# EAGLE design mctl5 (EAGLE 7.5.0)
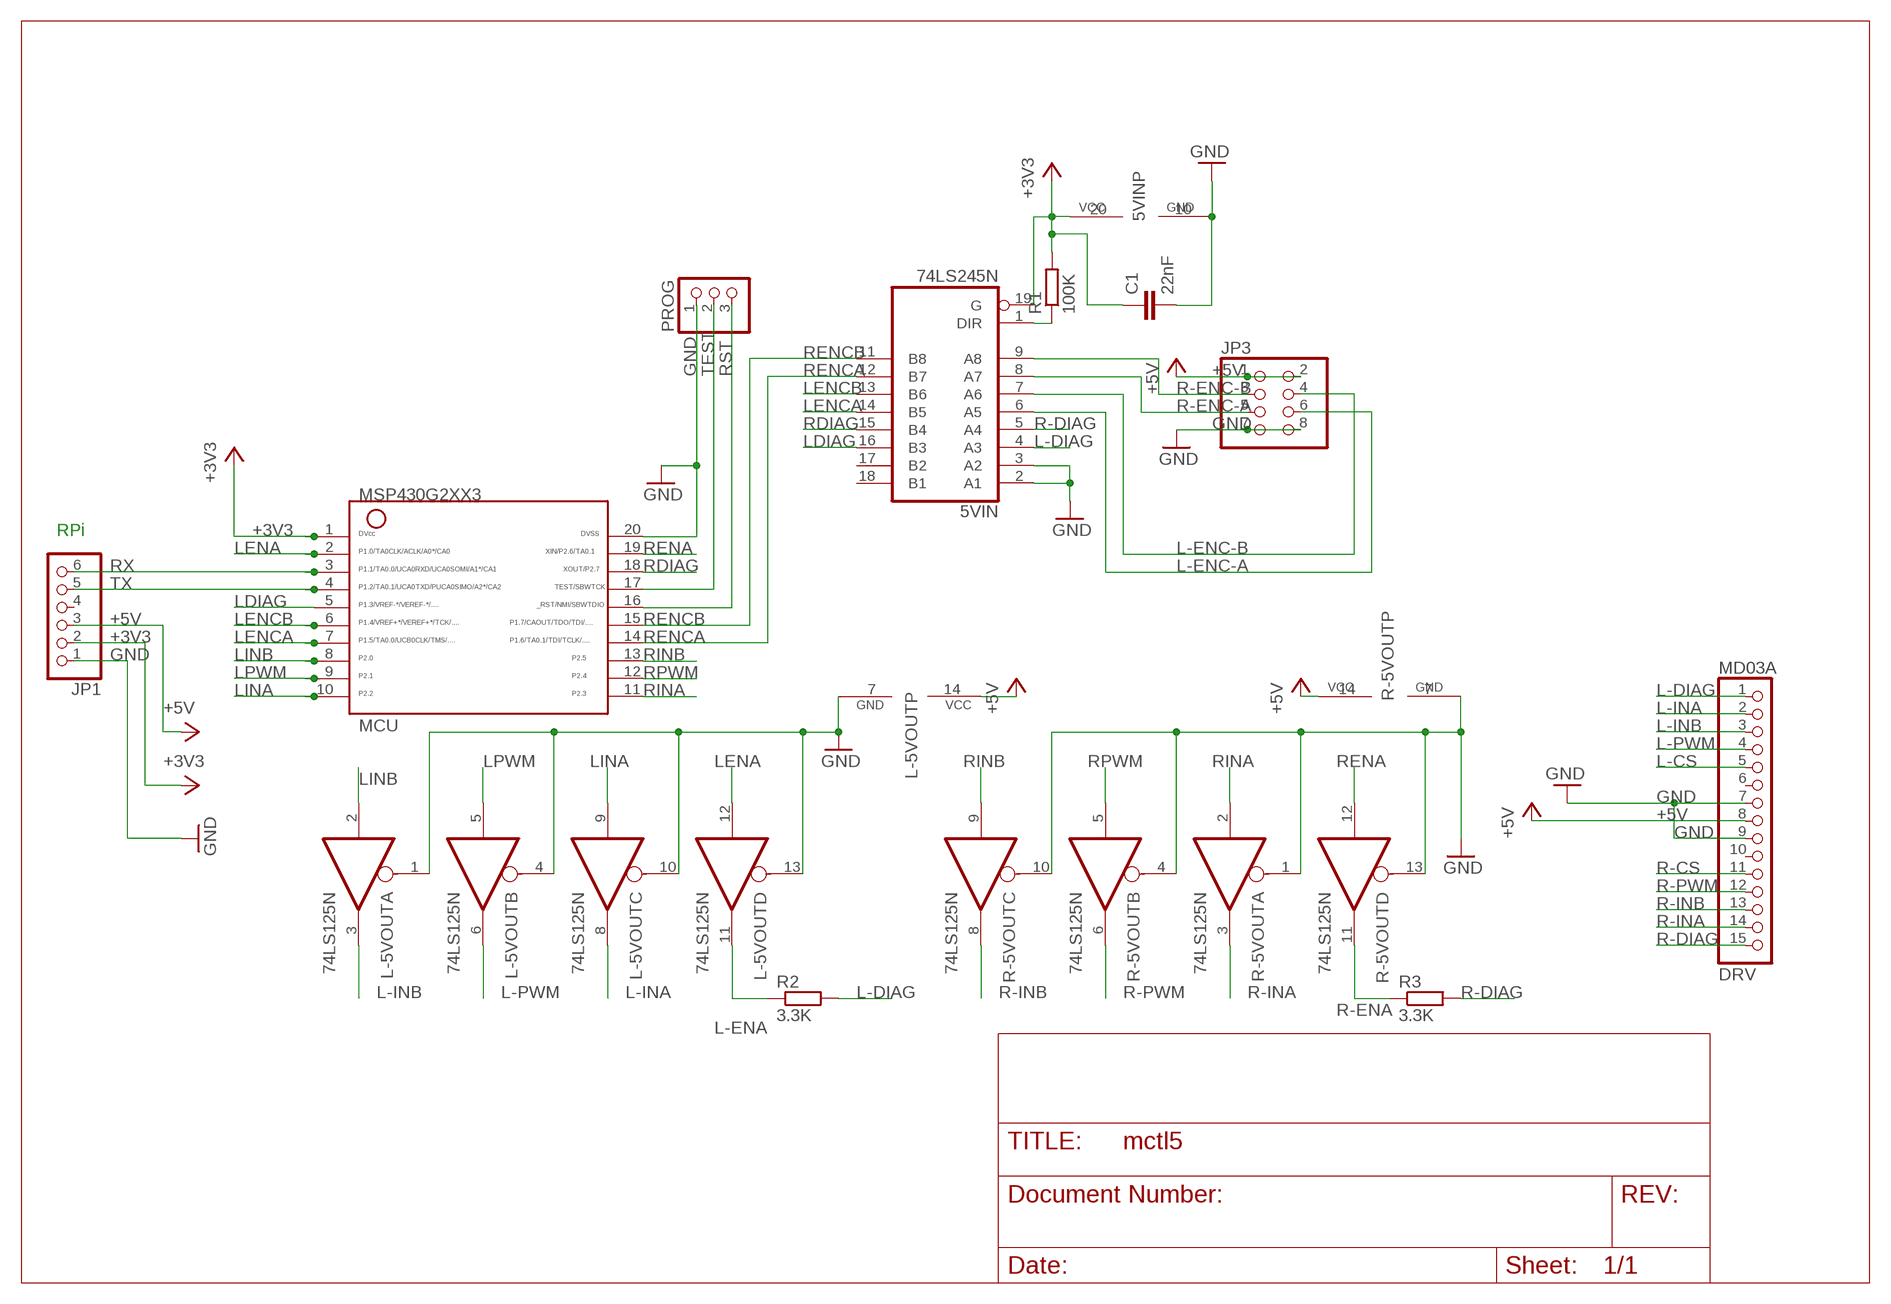
[diagram p0: schematic, sheet 1]

## Parts
5VIN  74LS245N  [DIL20]
C1  22nF  C-EU025-024X044  [C025-024X044]
JP1  PINHD-1X6  [1X06]
JP3  PINHD-2X4  [2X04]
L-5VOUT  74LS125N  [DIL14]
MCU  G2XX3---N20  [N20]
MD03A  DRV  PINHD-1X15-CB  [1X15-CB]
PROG  PINHD-1X3  [1X03]
R1  100K  R-EU_0204/7  [0204/7]
R2  3.3K  R-EU_0204/7  [0204/7]
R3  3.3K  R-EU_0204/7  [0204/7]
R-5VOUT  74LS125N  [DIL14]

## Nets
+3V3: 5VIN.19(G) 5VIN.20(VCC) C1.1 JP1.2 MCU.1 R1.2
+5V: JP1.3 JP3.1 JP3.2 L-5VOUT.14(P:VCC) MD03A.8 R-5VOUT.14(P:VCC)
GND: 5VIN.2(A1) 5VIN.3(A2) 5VIN.10(GND) C1.2 JP1.1 JP3.7 JP3.8 L-5VOUT.1(A:OE) L-5VOUT.4(B:OE) L-5VOUT.7(P:GND) L-5VOUT.10(C:OE) L-5VOUT.13(D:OE) MCU.20 MD03A.7 MD03A.9 PROG.1 R-5VOUT.1(A:OE) R-5VOUT.4(B:OE) R-5VOUT.7(P:GND) R-5VOUT.10(C:OE) R-5VOUT.13(D:OE)
L-CS: MD03A.5
L-DIAG: 5VIN.4(A3) MD03A.1 R2.2
L-ENA: L-5VOUT.11(D:O) R2.1
L-ENC-A: 5VIN.6(A5) JP3.6
L-ENC-B: 5VIN.7(A6) JP3.4
L-INA: L-5VOUT.8(C:O) MD03A.2
L-INB: L-5VOUT.3(A:O) MD03A.3
L-PWM: L-5VOUT.6(B:O) MD03A.4
LDIAG: 5VIN.16(B3) MCU.5
LENA: L-5VOUT.12(D:I) MCU.2
LENCA: 5VIN.14(B5) MCU.7
LENCB: 5VIN.13(B6) MCU.6
LINA: L-5VOUT.9(C:I) MCU.10
LINB: L-5VOUT.2(A:I) MCU.8
LPWM: L-5VOUT.5(B:I) MCU.9
N$1: 5VIN.1(DIR) R1.1
R-CS: MD03A.11
R-DIAG: 5VIN.5(A4) MD03A.15 R3.2
R-ENA: R3.1 R-5VOUT.11(D:O)
R-ENC-A: 5VIN.8(A7) JP3.5
R-ENC-B: 5VIN.9(A8) JP3.3
R-INA: MD03A.14 R-5VOUT.3(A:O)
R-INB: MD03A.13 R-5VOUT.8(C:O)
R-PWM: MD03A.12 R-5VOUT.6(B:O)
RDIAG: 5VIN.15(B4) MCU.18
RENA: MCU.19 R-5VOUT.12(D:I)
RENCA: 5VIN.12(B7) MCU.14
RENCB: 5VIN.11(B8) MCU.15
RINA: MCU.11 R-5VOUT.2(A:I)
RINB: MCU.13 R-5VOUT.9(C:I)
RPWM: MCU.12 R-5VOUT.5(B:I)
RST: MCU.16 PROG.3
RX: JP1.6 MCU.3
TEST: MCU.17 PROG.2
TX: JP1.5 MCU.4
Unconnected: 5VIN.17(B2) 5VIN.18(B1) JP1.4 MD03A.6 MD03A.10

## Notes on the sheet
- RPi

## Library data of the parts
5VIN = adafruit:74*245: Octal BUS TRANSCEIVER, 3-state
C1 = rcl:C-EU: CAPACITOR, European symbol
JP1 = adafruit:PINHD-1X6: PIN HEADER
JP3 = adafruit:PINHD-2X4: PIN HEADER
L-5VOUT R-5VOUT = 74xx-us:74*125: Quad bus BUFFER, 3-state
MCU = TI_MSP430_v16:G2XX3---N20: MSP430G2XX1 PDIP (N) 20 Pin Package
MD03A = adafruit:PINHD-1X15: PIN HEADER
PROG = adafruit:PINHD-1X3: PIN HEADER
R1-R3 = resistor:R-EU_: RESISTOR, European symbol

## Board
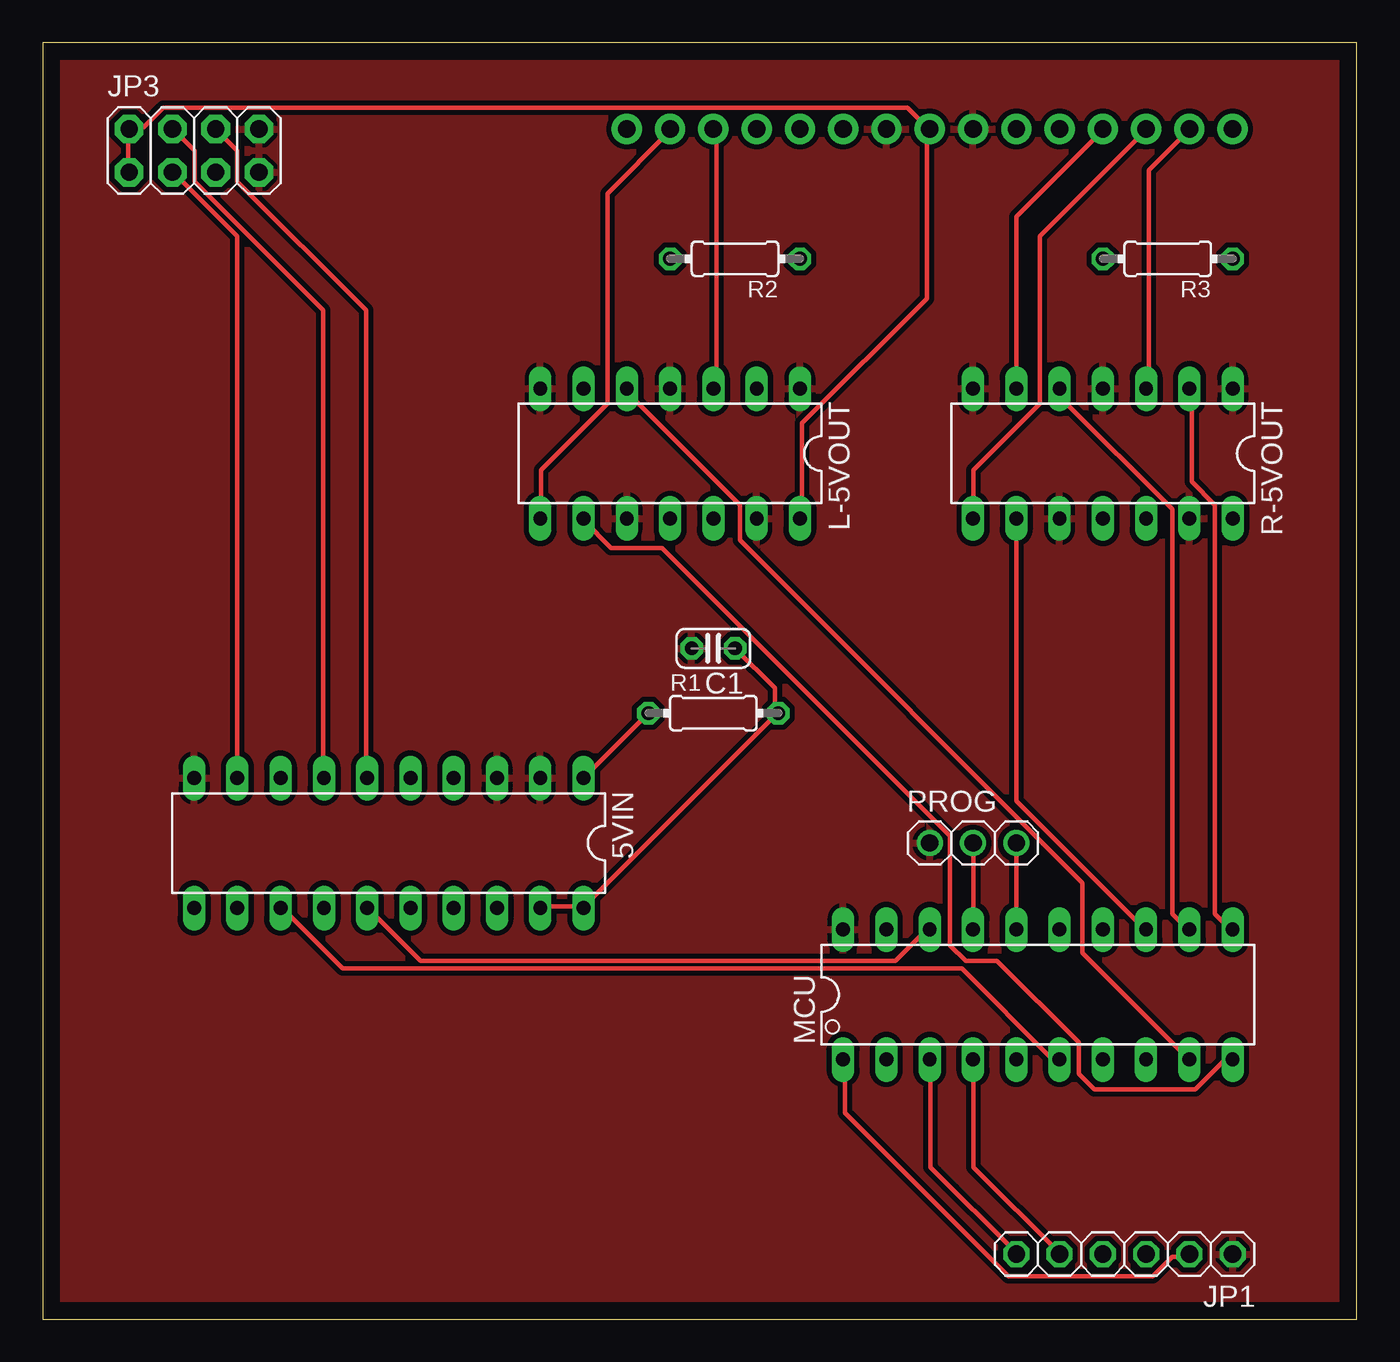
[diagram p1: board, top side]
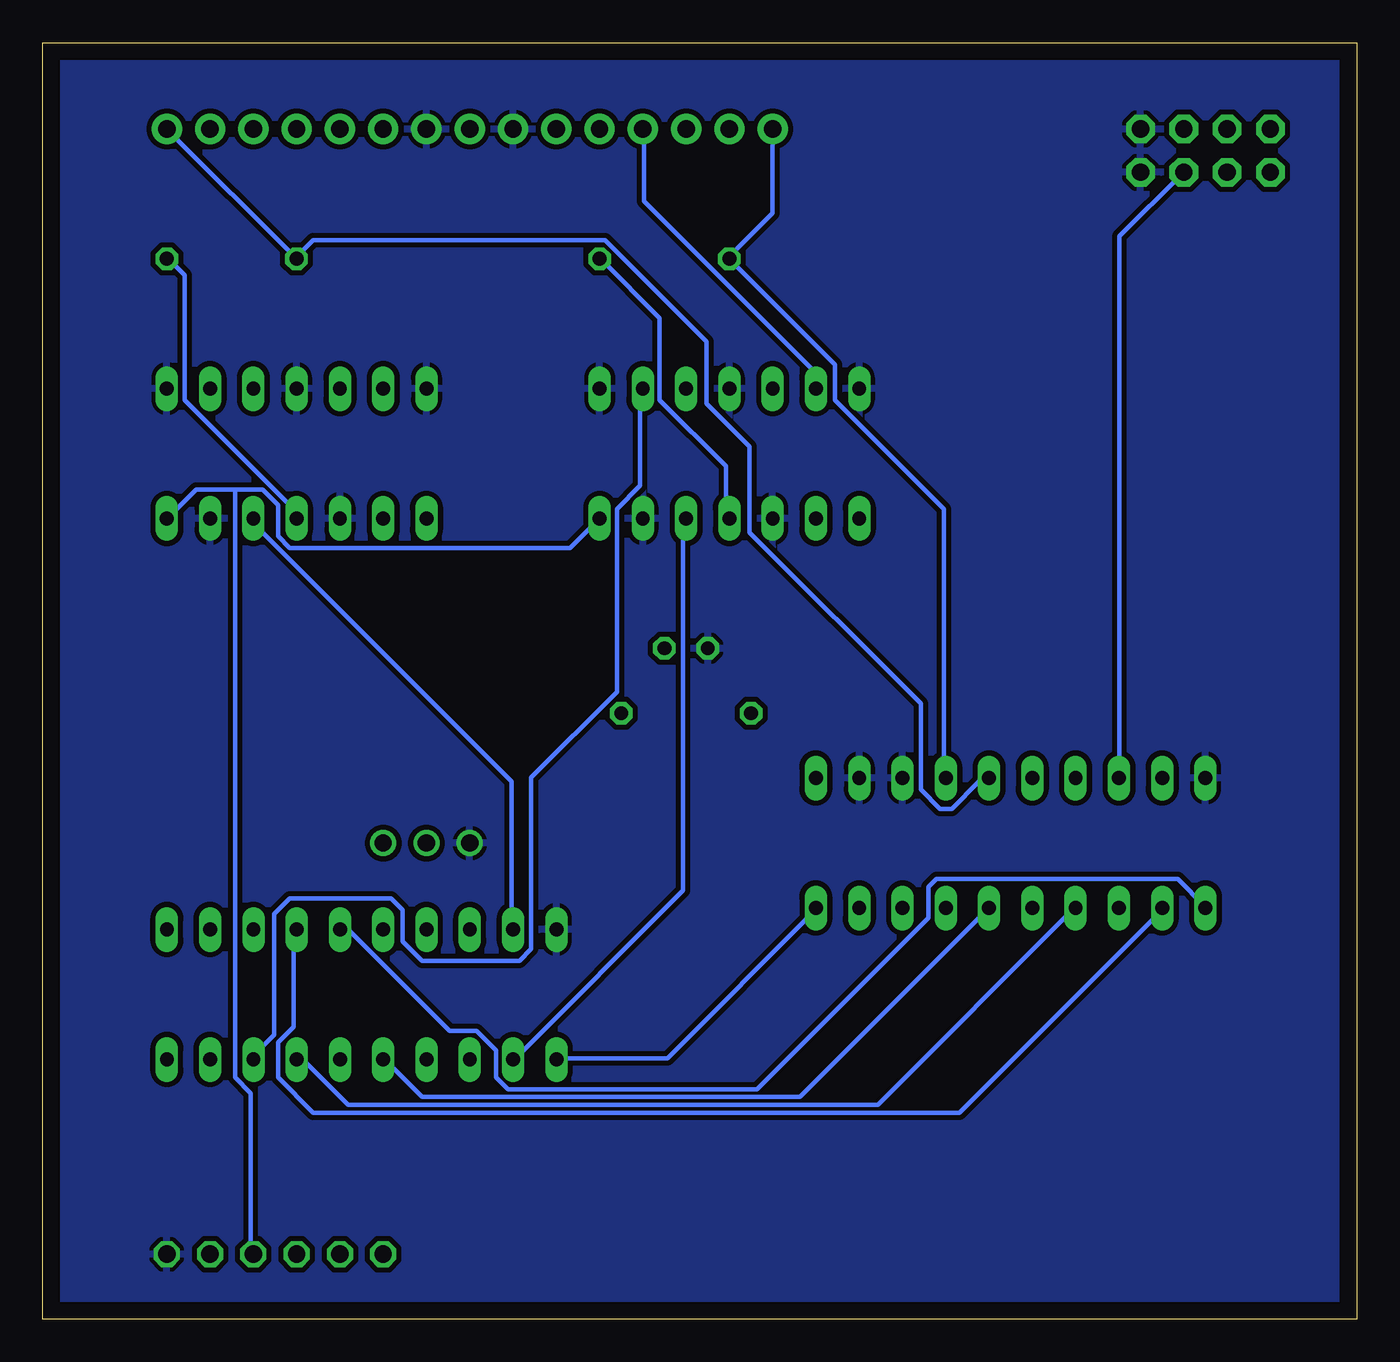
[diagram p2: board, bottom side, seen from below]

Size 77.14 x 74.92 mm. Coordinates in mm from the lower left corner, seen from the top.
Outline: 0,0 77.14,0 77.14,74.92 0,74.92 0,0
Copper layers (1*16): Top 0.035mm / dielectric 1.5mm / Bottom 0.035mm
Design rules "default": minimum track width 10mil, minimum drill 24mil, track to track 8mil, track to pad 8mil, pad to pad 8mil, via to via 8mil, smd to smd 8mil, copper to edge 40mil, drill to drill 8mil, minimum pad ring 10mil, minimum via ring 8mil, stop-mask expansion 4mil, vias tented up to drill 0mil, thermal gap 10mil

### Footprints (pad centres in the part's own frame; a part is rotated, then mirrored left to right if it is on the bottom)
DIL20 = drill 0.813 long: 1 -11.43,-3.81; 2 -8.89,-3.81; 3 -6.35,-3.81; 4 -3.81,-3.81; 5 -1.27,-3.81; 6 1.27,-3.81; 7 3.81,-3.81; 8 6.35,-3.81; 9 8.89,-3.81; 10 11.43,-3.81; 11 11.43,3.81; 12 8.89,3.81; 13 6.35,3.81; 14 3.81,3.81; 15 1.27,3.81; 16 -1.27,3.81; 17 -3.81,3.81; 18 -6.35,3.81; 19 -8.89,3.81; 20 -11.43,3.81
C025-024X044 = drill 0.813 octagon: 1 -1.27,0; 2 1.27,0
1X06 = drill 1.016 octagon: 1 -6.35,0; 2 -3.81,0; 3 -1.27,0; 4 1.27,0; 5 3.81,0; 6 6.35,0
2X04 = drill 1.016 pad 1.676 octagon: 1 -3.81,-1.27; 2 -3.81,1.27; 3 -1.27,-1.27; 4 -1.27,1.27; 5 1.27,-1.27; 6 1.27,1.27; 7 3.81,-1.27; 8 3.81,1.27
DIL14 = drill 0.813 long: 1 -7.62,-3.81; 2 -5.08,-3.81; 3 -2.54,-3.81; 4 0,-3.81; 5 2.54,-3.81; 6 5.08,-3.81; 7 7.62,-3.81; 8 7.62,3.81; 9 5.08,3.81; 10 2.54,3.81; 11 0,3.81; 12 -2.54,3.81; 13 -5.08,3.81; 14 -7.62,3.81
N20 = drill 0.813 long: 1 -11.435,-3.81; 2 -8.895,-3.81; 3 -6.355,-3.81; 4 -3.815,-3.81; 5 -1.275,-3.81; 6 1.265,-3.81; 7 3.805,-3.81; 8 6.345,-3.81; 9 8.885,-3.81; 10 11.425,-3.81; 11 11.425,3.81; 12 8.885,3.81; 13 6.345,3.81; 14 3.805,3.81; 15 1.265,3.81; 16 -1.275,3.81; 17 -3.815,3.81; 18 -6.355,3.81; 19 -8.895,3.81; 20 -11.435,3.81
1X15-CB = drill 1.016 pad 1.778: 1 -17.78,0; 2 -15.24,0; 3 -12.7,0; 4 -10.16,0; 5 -7.62,0; 6 -5.08,0; 7 -2.54,0; 8 0,0; 9 2.54,0; 10 5.08,0; 11 7.62,0; 12 10.16,0; 13 12.7,0; 14 15.24,0; 15 17.78,0
1X03 = drill 1.016: 1 -2.54,0; 2 0,0; 3 2.54,0
0204/7 = drill 0.813 octagon: 1 -3.81,0; 2 3.81,0

### Placement (x,y rotation side)
5VIN  20.32,27.94 180 top
C1  39.37,39.37 180 top
JP1  63.5,3.81 180 top
JP3  8.89,68.58 0 top
L-5VOUT  36.83,50.8 180 top
MCU  58.42,19.05 0 top
MD03A  52.07,69.85 0 top
PROG  54.61,27.94 0 top
R1  39.37,35.56 0 top
R2  40.64,62.23 180 top
R3  66.04,62.23 180 top
R-5VOUT  62.23,50.8 180 top

### Tracks (layer width: path | path; a pad name or v marks a point on that pad's centre or on a via)
+3V3
  Top 0.254: C1.1 42.98,37.03 42.98,35.66 R1.2 42.98,35.43 31.77,24.23 5VIN.20 31.55,24.23 29.26,24.23 5VIN.19 | JP1.2 67.21,3.66 66.29,3.66 65.15,2.52 56.69,2.52 47.09,12.12 47.09,15.09 MCU.1
  Bottom 0.254: MCU.1 46.86,15.32 40.46,15.32 31.77,24 5VIN.20
+5V
  Top 0.254: JP3.1 5.03,67.44 5.03,69.72 JP3.2 5.26,69.95 5.94,69.95 7.09,71.09 50.75,71.09 51.89,69.95 MD03A.8 51.89,69.72 51.89,59.89 44.58,52.58 44.58,47.09 L-5VOUT.14
  Bottom 0.254: 65.84,48.69 64.24,48.69 63.32,47.78 63.32,45.95 62.64,45.26 46.18,45.26 L-5VOUT.14 | 65.84,48.69 68.12,48.69 69.72,47.09 R-5VOUT.14 | 65.84,48.69 65.84,14.17 64.92,13.26 64.92,3.89 JP1.3
GND
  pour Bottom (isolate 0.305): 0,74.93 77.47,74.93 77.47,0 0,0
  pour Top (isolate 0.305): 0,74.93 77.47,74.93 77.47,0 0,0
L-DIAG
  Bottom 0.254: 5VIN.4 24.23,31.77 24.23,47.55 30.63,53.95 30.63,56.01 36.8,62.18 R2.2 36.8,62.41 34.29,64.92 MD03A.1
L-ENA
  Bottom 0.254: L-5VOUT.11 37.03,47.09 37.03,50.06 40.92,53.95 40.92,58.75 44.35,62.18 R2.1
L-ENC-A
  Top 0.254: JP3.6 11.43,68.58 11.43,66.75 18.97,59.21 18.97,31.77 5VIN.6
L-ENC-B
  Top 0.254: 5VIN.7 16.46,31.77 16.46,59.21 8.91,66.75 8.91,68.58 7.77,69.72 JP3.4
L-INA
  Top 0.254: L-5VOUT.8 29.26,47.09 29.26,49.84 33.15,53.72 33.15,66.06 36.8,69.72 MD03A.2
L-INB
  Top 0.254: L-5VOUT.3 39.55,54.63 39.55,69.72 MD03A.3
L-PWM
  Bottom 0.254: L-5VOUT.6 31.77,54.63 31.77,55.55 41.83,65.61 41.83,69.72 MD03A.4
LDIAG
  Bottom 0.254: 5VIN.16 32.69,13.03 54.86,13.03 56.92,15.09 MCU.5
LENA
  Bottom 0.254: L-5VOUT.12 39.55,46.86 39.55,25.15 49.38,15.32 MCU.2
LENCA
  Bottom 0.254: MCU.7 62.18,15.09 61.72,15.09 59.21,12.57 28.12,12.57 16.69,24 5VIN.14
LENCB
  Top 0.254: MCU.6 59.66,15.32 59.21,15.32 53.95,20.57 17.6,20.57 14.17,24 5VIN.13
LINA
  Top 0.254: MCU.10 69.72,15.09 69.27,15.09 67.67,13.49 61.72,13.49 60.81,14.4 60.81,16.23 56.01,21.03 54.18,21.03 53.26,21.95 53.26,28.35 36.35,45.26 33.38,45.26 31.77,46.86 L-5VOUT.9
LINB
  Bottom 0.254: L-5VOUT.2 42.06,54.41 42.06,48.92 43.43,47.55 43.43,36.8 48.46,31.77 48.46,21.72 49.15,21.03 54.86,21.03 56.01,22.17 56.01,24 56.69,24.69 62.64,24.69 63.55,23.77 63.55,16.69 64.92,15.32 MCU.8
LPWM
  Top 0.254: L-5VOUT.5 34.29,54.41 40.92,47.78 40.92,45.72 61.04,25.6 61.04,21.49 67.21,15.32 MCU.9
N$1
  Top 0.254: R1.1 5VIN.1
R-DIAG
  Bottom 0.254: 5VIN.5 21.72,31.55 22.17,31.55 23.77,29.95 24.46,29.95 25.6,31.09 25.6,36.12 35.66,46.18 35.66,51.21 38.18,53.72 38.18,57.38 44.12,63.32 61.27,63.32 62.18,62.41 R3.2 MD03A.15
R-ENA
  Bottom 0.254: R-5VOUT.11 62.41,47.09 62.41,47.55 68.81,53.95 68.81,61.27 69.72,62.18 R3.1
R-ENC-A
  Bottom 0.254: 5VIN.8 13.95,31.77 13.95,63.55 10.29,67.21 JP3.5
R-ENC-B
  Top 0.254: 5VIN.9 11.43,63.55 7.77,67.21 JP3.3
R-INA
  Top 0.254: R-5VOUT.3 64.92,54.63 64.92,67.44 67.21,69.72 MD03A.14
R-INB
  Top 0.254: R-5VOUT.8 54.63,47.09 54.63,49.84 58.52,53.72 58.52,63.55 64.69,69.72 MD03A.13
R-PWM
  Top 0.254: R-5VOUT.6 57.15,64.69 62.18,69.72 MD03A.12
RDIAG
  Top 0.254: MCU.18 51.89,22.86 50.06,21.03 22.17,21.03 19.2,24 5VIN.15
RENA
  Bottom 0.254: MCU.19 49.61,22.86 49.61,31.55 64.92,46.86 R-5VOUT.12
RENCA
  Bottom 0.254: MCU.14 62.41,22.86 62.41,17.14 63.32,16.23 63.32,14.17 61.27,12.12 23.32,12.12 11.43,24 5VIN.12
RENCB
  Bottom 0.254: MCU.15 59.21,22.86 53.26,16.92 51.66,16.92 50.52,15.77 50.52,14.17 49.84,13.49 35.2,13.49 25.15,23.55 25.15,25.38 24.69,25.83 10.52,25.83 8.91,24.23 5VIN.11
RINA
  Top 0.254: R-5VOUT.2 67.44,54.41 67.44,49.15 68.81,47.78 68.81,23.77 69.72,22.86 MCU.11
RINB
  Top 0.254: R-5VOUT.9 57.15,30.4 64.69,22.86 MCU.13
RPWM
  Top 0.254: R-5VOUT.5 59.89,54.41 59.89,53.95 66.29,47.55 66.29,23.77 67.21,22.86 MCU.12
RST
  Top 0.254: PROG.3 MCU.16
RX
  Top 0.254: MCU.3 52.12,15.09 52.12,8.91 57.15,3.89 JP1.6
TEST
  Top 0.254: MCU.17 54.63,22.86 54.63,27.89 PROG.2
TX
  Top 0.254: MCU.4 54.63,15.09 54.63,8.91 59.66,3.89 JP1.5